# Altium schematic sheet MCU.SchDoc
size A
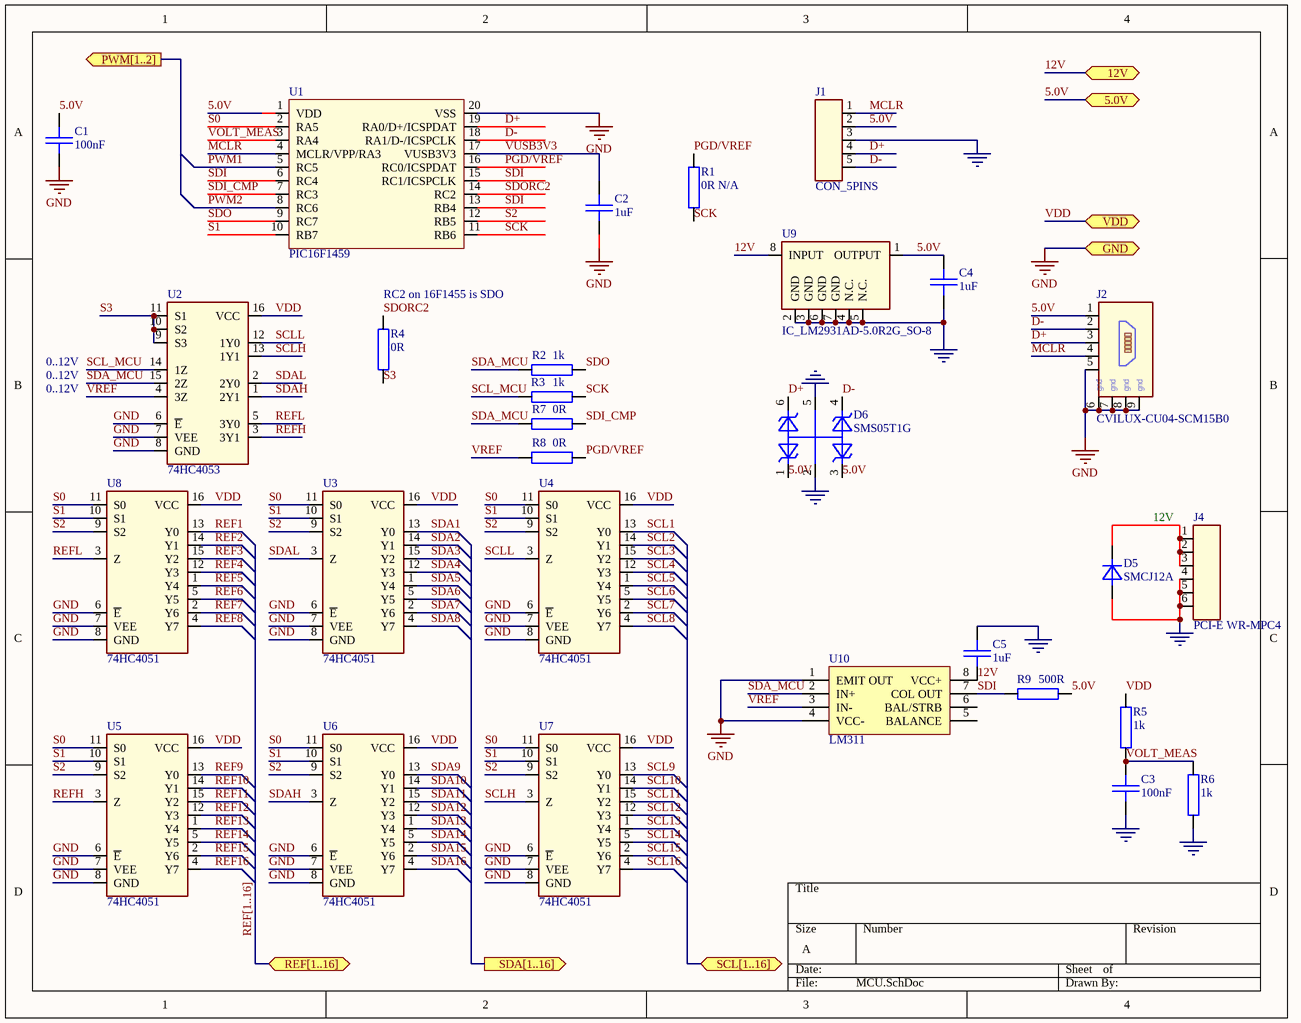
[diagram p0: MCU.SchDoc]

## Parts
C1  100nF  [SMD_0603_CAPC1608X95N]
C2  1uF  [SMD_0603_CAPC1608X95N]
C3  100nF  [SMD_0603_CAPC1608X95N]
C4  1uF  [SMD_0603_CAPC1608X95N]
C5  1uF  [SMD_0603_CAPC1608X95N]
D5  SMCJ12A  [SMD_DO214AC_SMC]
D6  SMS05T1G  [SMD_SOT95P280X145-6N]
J1  CON_5PINS  [SIP5 - PGM]
J2  CVILUX-CU04-SCM15B0  [SMD_CON-CVILUX-CU04-SCM15B0]
J4  PCI-E WR-MPC4  [PTH_CON_WR-MRC4-6P_S]
R1  0R N/A  [SMD_0603_RESC1608X55N]
R2  1k  [SMD_0603_RESC1608X55N]
R3  1k  [SMD_0603_RESC1608X55N]
R4  0R  [SMD_0603_RESC1608X55N]
R5  1k  [SMD_0603_RESC1608X55N]
R6  1k  [SMD_0603_RESC1608X55N]
R7  0R  [SMD_0603_RESC1608X55N]
R8  0R  [SMD_0603_RESC1608X55N]
R9  500R  [SMD_0603_RESC1608X55N]
U1  PIC16F1459  [SMD_SOP65P640X110-20N]
U2  74HC4053  [SMD_SOIC127P600X175-16N]
U3  74HC4051  [SMD_SOIC127P600X175-16N]
U4  74HC4051  [SMD_SOIC127P600X175-16N]
U5  74HC4051  [SMD_SOIC127P600X175-16N]
U6  74HC4051  [SMD_SOIC127P600X175-16N]
U7  74HC4051  [SMD_SOIC127P600X175-16N]
U8  74HC4051  [SMD_SOIC127P600X175-16N]
U9  IC_LM2931AD-5.0R2G_SO-8  [SMD_SOIC127P600X175-8N]
U10  LM311  [SMD_SOIC127P600X175-8N]

## Ports
5.0V, 12V, GND, PWM[1..2] (out), REF[1..16], SCL[1..16], SDA[1..16] (out), VDD

## Nets
GND: C1.2 C2.2 C3.2 C4.2 C5.1 D5.2(A) D6.2(AAAA) D6.5(C4) J1.3 J2.5 J2.6 J2.7 J2.8 J2.9 J4.4 J4.5 J4.6 R6.2 U1.20(VSS) U2.6(~{E}) U2.7(VEE) U2.8(GND) U3.6(~{E}) U3.7(VEE) U3.8(GND) U4.6(~{E}) U4.7(VEE) U4.8(GND) U5.6(~{E}) U5.7(VEE) U5.8(GND) U6.6(~{E}) U6.7(VEE) U6.8(GND) U7.6(~{E}) U7.7(VEE) U7.8(GND) U8.6(~{E}) U8.7(VEE) U8.8(GND) U9.2(GND) U9.3(GND) U9.4(N.C.) U9.5(N.C.) U9.6(GND) U9.7(GND) U10.1(EMIT_OUT) U10.4(VCC-) ; port GND
5.0V: C1.1 C4.1 D6.1(C1) D6.3(C2) J1.2 J2.1 R9.2 U1.1(VDD) U9.1(OUTPUT) ; port 5.0V
12V: C5.2 D5.1(C) J4.1 J4.2 J4.3 U9.8(INPUT) U10.8(VCC+) ; port 12V
D+: D6.6(C4) J1.4 J2.3 U1.19(RA0/D+/ICSPDAT)
D-: D6.4(C3) J1.5 J2.2 U1.18(RA1/D-/ICSPCLK)
MCLR: J1.1 J2.4 U1.4(MCLR/VPP/RA3)
PGD/VREF: R1.1 R8.1 U1.16(RC0/ICSPDAT)
PWM1: U1.5(RC5)
PWM2: U1.8(RC6)
REF1: U8.13(Y0)
REF2: U8.14(Y1)
REF3: U8.15(Y2)
REF4: U8.12(Y3)
REF5: U8.1(Y4)
REF6: U8.5(Y5)
REF7: U8.2(Y6)
REF8: U8.4(Y7)
REF9: U5.13(Y0)
REF10: U5.14(Y1)
REF11: U5.15(Y2)
REF12: U5.12(Y3)
REF13: U5.1(Y4)
REF14: U5.5(Y5)
REF15: U5.2(Y6)
REF16: U5.4(Y7)
REFH: U2.3(3Y1) U5.3(Z)
REFL: U2.5(3Y0) U8.3(Z)
S0: U1.2(RA5) U3.11(S0) U4.11(S0) U5.11(S0) U6.11(S0) U7.11(S0) U8.11(S0)
S1: U1.10(RB7) U3.10(S1) U4.10(S1) U5.10(S1) U6.10(S1) U7.10(S1) U8.10(S1)
S2: U1.12(RB5) U3.9(S2) U4.9(S2) U5.9(S2) U6.9(S2) U7.9(S2) U8.9(S2)
S3: R4.1 U2.9(S3) U2.10(S2) U2.11(S1)
SCK: R1.2 R3.2 U1.11(RB6)
SCL1: U4.13(Y0)
SCL2: U4.14(Y1)
SCL3: U4.15(Y2)
SCL4: U4.12(Y3)
SCL5: U4.1(Y4)
SCL6: U4.5(Y5)
SCL7: U4.2(Y6)
SCL8: U4.4(Y7)
SCL9: U7.13(Y0)
SCL10: U7.14(Y1)
SCL11: U7.15(Y2)
SCL12: U7.12(Y3)
SCL13: U7.1(Y4)
SCL14: U7.5(Y5)
SCL15: U7.2(Y6)
SCL16: U7.4(Y7)
SCL_MCU: R3.1 U2.14(1Z)
SCLH: U2.13(1Y1) U7.3(Z)
SCLL: U2.12(1Y0) U4.3(Z)
SDA1: U3.13(Y0)
SDA2: U3.14(Y1)
SDA3: U3.15(Y2)
SDA4: U3.12(Y3)
SDA5: U3.1(Y4)
SDA6: U3.5(Y5)
SDA7: U3.2(Y6)
SDA8: U3.4(Y7)
SDA9: U6.13(Y0)
SDA10: U6.14(Y1)
SDA11: U6.15(Y2)
SDA12: U6.12(Y3)
SDA13: U6.1(Y4)
SDA14: U6.5(Y5)
SDA15: U6.2(Y6)
SDA16: U6.4(Y7)
SDA_MCU: R2.2 R7.2 U2.15(2Z) U10.2(IN+)
SDAH: U2.1(2Y1) U6.3(Z)
SDAL: U2.2(2Y0) U3.3(Z)
SDI: R9.1 U1.6(RC4) U1.13(RB4) U1.15(RC1/ICSPCLK) U10.7(COL_OUT)
SDI_CMP: R7.1 U1.7(RC3)
SDO: R2.1 U1.9(RC7)
SDORC2: R4.2 U1.14(RC2)
VDD: R5.1 U2.16(VCC) U3.16(VCC) U4.16(VCC) U5.16(VCC) U6.16(VCC) U7.16(VCC) U8.16(VCC) ; port VDD
VOLT_MEAS: C3.1 R5.2 R6.1 U1.3(RA4)
VREF: R8.2 U2.4(3Z) U10.3(IN-)
VUSB3V3: C2.1 U1.17(VUSB3V3)

Not connected (* = marked no-connect by the designer): U10 5(BALANCE) 6(BAL/STRB)

## Buses and harness runs
bus REF[1..16] = port REF[1..16]

## Notes on the sheet
- (near R4) RC2 on 16F1455 is SDO
- 0..12V
- (in symbol CON_USB_MINI) gnd

## Library data of the parts
C1-C5 = C: NOTE: <NOTE>
D5 = D: NOTE: <NOTE>
D6 = D_TVS_QUAD_C1AA2AA5C3C4C6: 4 IO lines TVS; NOTE: <NOTE>
J1 = CON_5PINS: NOTE: <NOTE>
J2 = CON_USB_MINI: NOTE: <NOTE>
J4 = CON_6PINS: NOTE: <NOTE>
R1-R9 = R: NOTE: <NOTE>; R_BDS: R
U1 = IC_PIC16F1459
U2 = IC_74HC4053: Triple 2-channel analog multiplexer/demultiplexer
U3-U8 = IC_74HC4051: 8-channel analog multiplexer/demultiplexer
U10 = IC_LM311: Comparator